# Altium schematic sheet POWER.SchDoc
size A; SheetNumber: 6; SheetTotal: 7
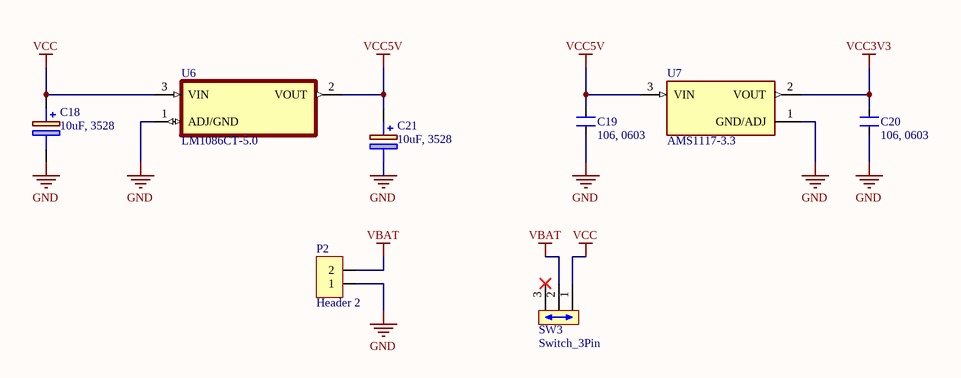
[diagram p0: POWER.SchDoc]

## Parts
C18  10uF, 3528  [CAP-TANTAL-3528]
C19  106, 0603  [SM-0603]
C20  106, 0603  [SM-0603]
C21  10uF, 3528  [CAP-TANTAL-3528]
P2  Header 2  [HDR/Header/2]
SW3  Switch_3Pin  [SW-12F23]
U6  LM1086CT-5.0  [TO254P1054X470X1955-3]
U7  AMS1117-3.3  [SOT229P700X180-4N]

## Nets
GND: C18.2 C19.1 C20.1 C21.2 P2.1 U6.1(ADJ/GND) U7.1(GND/ADJ)
VBAT: P2.2 SW3.2(COMMON)
VCC: C18.1 SW3.1 U6.3(VIN)
VCC3V3: C20.2 U7.2(VOUT)
VCC5V: C19.2 C21.1 U6.2(VOUT) U7.3(VIN)

Not connected (* = marked no-connect by the designer): SW3 3*

## Library data of the parts
C18 C21 = CAP Tantalum: Tantalum Capacitor
C19 C20 = CM: Cap SMD; Value: 103
P2 = Header 2: Header, 2-Pin
SW3 = Switch_3Pin: Switch; Published: 24-Mar-1999; LatestRevisionDate: 17-Jul-2002; LatestRevisionNote: Re-released for DXP Platform.; PackageReference: SPST-2; Publisher: Altium Limited
U6 = LM1086CT-5.0: MF: {'manufacturer': u'Texas Instruments'}; MP: LM1086CT-5.0/NOPB; Package: None; Price: None; Value: *; Availability: Unavailable
U7 = AMS1117-3.3: MF: {'manufacturer': u'Advanced Monolithic Systems'}; Package: None; Price: None; Value: *; MP: AMS1117-3.3; Availability: Unavailable